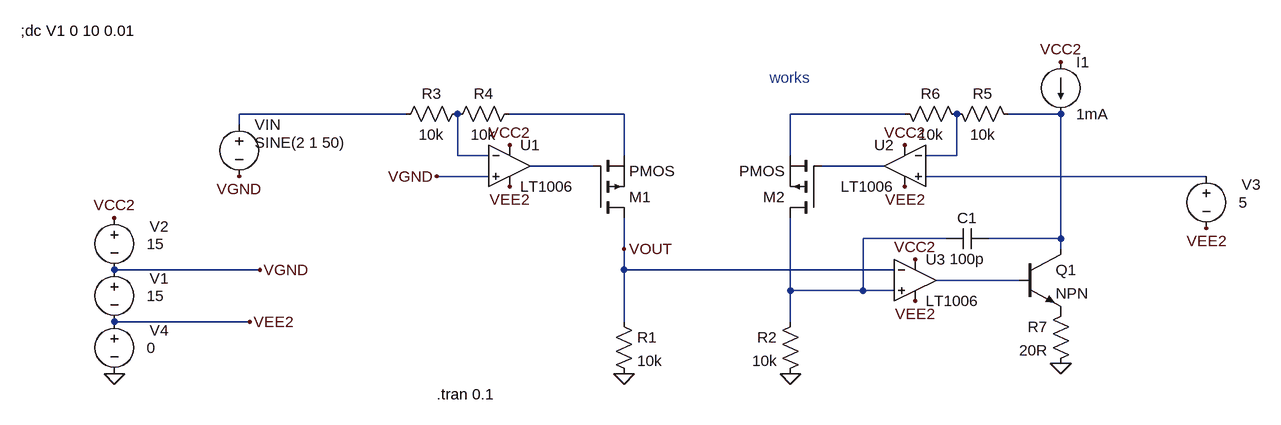
[diagram p0: schematic Draft18.asc]
Draft18.asc, the LTspice schematic file:
Version 4
SHEET 1 1576 680
WIRE 256 16 0 16
WIRE 592 16 416 16
WIRE 1024 16 848 16
WIRE 1264 16 1184 16
WIRE 0 32 0 16
WIRE 336 80 336 16
WIRE 384 80 336 80
WIRE 592 80 592 16
WIRE 848 80 848 16
WIRE 1104 80 1104 16
WIRE 1104 80 1056 80
WIRE 544 96 448 96
WIRE 992 96 896 96
WIRE 384 112 304 112
WIRE 1488 112 1056 112
WIRE 1088 208 960 208
WIRE 1264 208 1264 16
WIRE 1264 208 1152 208
WIRE 592 224 592 176
WIRE 1264 224 1264 208
WIRE 32 256 -192 256
WIRE 592 256 592 224
WIRE 1008 256 592 256
WIRE 1200 272 1072 272
WIRE 848 288 848 176
WIRE 960 288 960 208
WIRE 960 288 848 288
WIRE 1008 288 960 288
WIRE 16 336 -192 336
WIRE 592 336 592 256
WIRE 848 336 848 288
FLAG -192 416 0
FLAG 16 336 VEE2
FLAG -192 176 VCC2
FLAG 592 416 0
FLAG 416 128 VEE2
FLAG 416 64 VCC2
FLAG 592 224 VOUT
FLAG 304 112 VGND
FLAG 32 256 VGND
FLAG 0 112 VGND
FLAG 848 416 0
FLAG 1024 128 VEE2
FLAG 1024 64 VCC2
FLAG 1264 400 0
FLAG 1040 240 VCC2
FLAG 1040 304 VEE2
FLAG 1264 -64 VCC2
FLAG 1488 192 VEE2
SYMBOL voltage 0 16 R0
WINDOW 123 0 0 Left 0
WINDOW 39 0 0 Left 0
WINDOW 3 24 44 Left 2
SYMATTR Value SINE(2 1 50)
SYMATTR InstName VIN
SYMBOL voltage -192 320 R0
WINDOW 0 54 29 Left 2
WINDOW 3 50 56 Left 2
WINDOW 123 0 0 Left 0
WINDOW 39 0 0 Left 0
SYMATTR InstName V4
SYMATTR Value 0
SYMBOL voltage -192 240 R0
WINDOW 0 54 29 Left 2
WINDOW 3 50 56 Left 2
WINDOW 123 0 0 Left 0
WINDOW 39 0 0 Left 0
SYMATTR InstName V1
SYMATTR Value 15
SYMBOL res 576 320 R0
SYMATTR InstName R1
SYMATTR Value 10k
SYMBOL OpAmps\\LT1006 416 32 R0
SYMATTR InstName U1
SYMBOL res 352 0 R90
WINDOW 0 0 56 VBottom 2
WINDOW 3 32 56 VTop 2
SYMATTR InstName R3
SYMATTR Value 10k
SYMBOL res 432 0 R90
WINDOW 0 0 56 VBottom 2
WINDOW 3 32 56 VTop 2
SYMATTR InstName R4
SYMATTR Value 10k
SYMBOL pmos 544 176 M180
SYMATTR InstName M1
SYMBOL voltage -192 160 R0
WINDOW 0 54 29 Left 2
WINDOW 3 50 56 Left 2
WINDOW 123 0 0 Left 0
WINDOW 39 0 0 Left 0
SYMATTR InstName V2
SYMATTR Value 15
SYMBOL res 864 320 M0
SYMATTR InstName R2
SYMATTR Value 10k
SYMBOL OpAmps\\LT1006 1024 32 M0
SYMATTR InstName U2
SYMBOL res 1088 0 M90
WINDOW 0 0 56 VBottom 2
WINDOW 3 32 56 VTop 2
SYMATTR InstName R5
SYMATTR Value 10k
SYMBOL res 1008 0 M90
WINDOW 0 0 56 VBottom 2
WINDOW 3 32 56 VTop 2
SYMATTR InstName R6
SYMATTR Value 10k
SYMBOL pmos 896 176 R180
SYMATTR InstName M2
SYMBOL npn 1200 224 R0
SYMATTR InstName Q1
SYMBOL OpAmps\\LT1006 1040 208 R0
SYMATTR InstName U3
SYMBOL res 1280 304 M0
SYMATTR InstName R7
SYMATTR Value 20R
SYMBOL current 1264 -64 R0
WINDOW 123 0 0 Left 0
WINDOW 39 0 0 Left 0
SYMATTR InstName I1
SYMATTR Value 1mA
SYMBOL cap 1152 192 R90
WINDOW 0 0 32 VBottom 2
WINDOW 3 32 32 VTop 2
SYMATTR InstName C1
SYMATTR Value 100p
SYMBOL voltage 1488 96 R0
WINDOW 0 54 29 Left 2
WINDOW 3 50 56 Left 2
WINDOW 123 0 0 Left 0
WINDOW 39 0 0 Left 0
SYMATTR InstName V3
SYMATTR Value 5
TEXT -336 -112 Left 2 !;dc V1 0 10 0.01
TEXT 304 448 Left 2 !.tran 0.1
TEXT 816 -40 Left 2 ;works

The netlist it stands for:
* Draft18.asc
VIN N001 VGND SINE(2 1 50)
V4 VEE2 0 0
V1 VGND VEE2 15
R1 VOUT 0 10k
XU1 VGND N005 VCC2 VEE2 N007 LT1006  ; pins In+ In- V+ V- OUT
R3 N005 N001 10k
R4 N002 N005 10k
M1 VOUT N007 N002 N002 PMOS
V2 VCC2 VGND 15
R2 N010 0 10k
XU2 N009 N006 VCC2 VEE2 N008 LT1006  ; pins In+ In- V+ V- OUT
R5 N006 N004 10k
R6 N003 N006 10k
M2 N010 N008 N003 N003 PMOS
Q1 N004 N011 P001 0 NPN
XU3 N010 VOUT VCC2 VEE2 N011 LT1006  ; pins In+ In- V+ V- OUT
R7 P001 0 20R
I1 VCC2 N004 1mA
C1 N004 N010 100p
V3 N009 VEE2 5
.model NPN NPN
.model PNP PNP
.lib standard.bjt
.model NMOS NMOS
.model PMOS PMOS
.lib standard.mos
;dc V1 0 10 0.01
.tran 0.1
* works
.lib LTC.lib
.backanno
.end